# Altium project CRD25DA12N-FMC V2 (09-2024).PrjPcb (part 9 of 9)
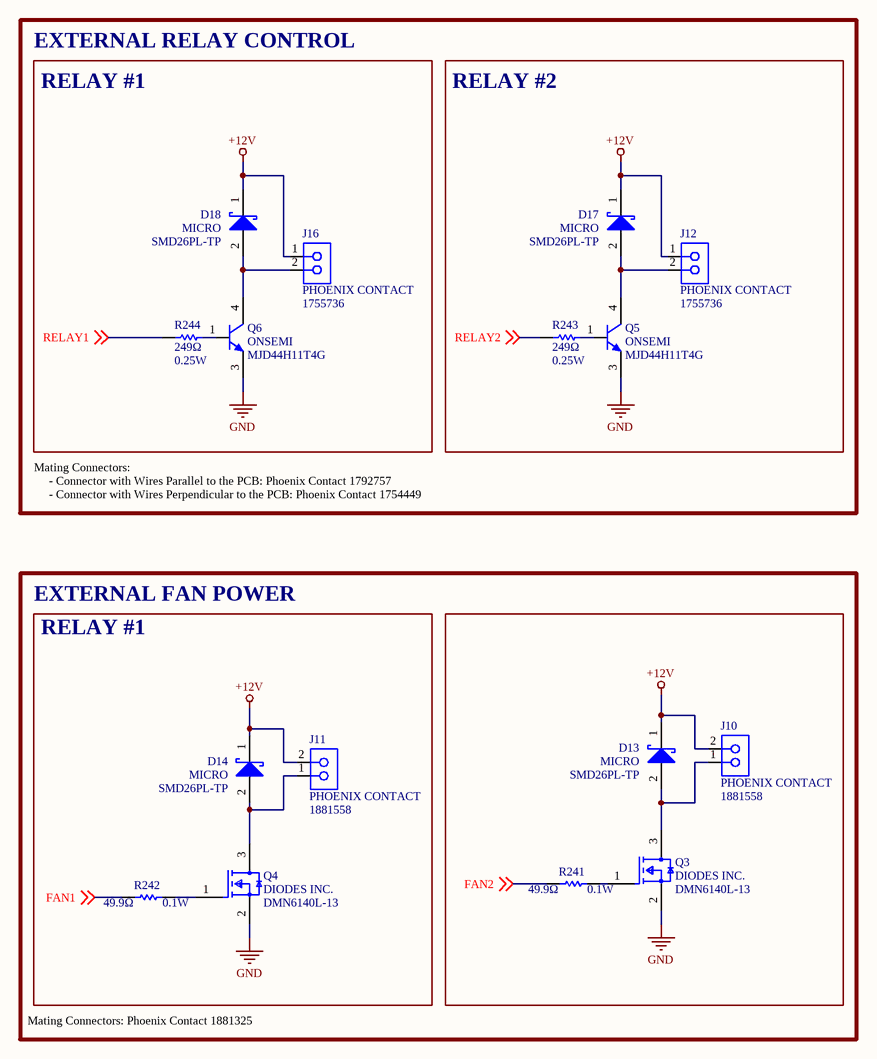
[diagram p12: 09 - Controlled Power.SchDoc]

## Nets that join several sheets
+1.65V_R: 04 - Auxiliary Power (C184.1 U43.1), 08 - Resolver (6 pins)
+1.65V_V: 04 - Auxiliary Power (C5.1 U31.1), 06 - Voltage Sense (R40.2 R42.2 R44.2)
+3.3V: 03 - Controller (16 pins), 04 - Auxiliary Power (8 pins), 06 - Voltage Sense (8 pins), 07 - Current-Temp Sense (14 pins), 08 - Resolver (8 pins)
+3.3V_I: 04 - Auxiliary Power (C13.1 U32.5), 07 - Current-Temp Sense (R199.2 R204.2 R210.2)
+5V: 03 - Controller (11 pins), 04 - Auxiliary Power (13 pins), 05 - Gate Drivers (11 pins)
+5V_ALT: 04 - Auxiliary Power (C56.1 U16.3), 05 - Gate Drivers (9 pins)
+5V_ISO: 03 - Controller (C141.1 J4.9 R192.2 U36.8), 04 - Auxiliary Power (C128.1 U8.5)
+5V_NTC: 04 - Auxiliary Power (C12.1 U6.5), 07 - Current-Temp Sense (C14.1 C17.1 R53.2 U7.1)
+12V: 02 - Power Stage (R80.1 R81.1 R115.1 R119.1), 03 - Controller (J9.12), 04 - Auxiliary Power (20 pins), 05 - Gate Drivers (6 pins), 09 - Controlled Power (8 pins)
+15V: 02 - Power Stage (6 pins), 04 - Auxiliary Power (14 pins), 08 - Resolver (12 pins)
-15V: 02 - Power Stage (6 pins), 04 - Auxiliary Power (11 pins)
GND: 02 - Power Stage (12 pins), 03 - Controller (53 pins), 04 - Auxiliary Power (81 pins), 05 - Gate Drivers (48 pins), 06 - Voltage Sense (20 pins), 07 - Current-Temp Sense (33 pins), 08 - Resolver (26 pins), 09 - Controlled Power (Q3.2 Q4.2 Q5.3 Q6.3)
GND_ISO: 03 - Controller (6 pins), 04 - Auxiliary Power (C128.2 U8.4)
GND_NTC: 02 - Power Stage (Q2.NTC1), 04 - Auxiliary Power (C12.2 U6.4), 07 - Current-Temp Sense (6 pins)
COS: 03 - Controller (U5.34), 08 - Resolver (C23.1 R62.2)
DC+: 02 - Power Stage (12 pins), 06 - Voltage Sense (R13.1)
DC-: 02 - Power Stage (12 pins), 06 - Voltage Sense (R160.1)
FAN1: 03 - Controller (U38.16), 09 - Controlled Power (R242.1)
FAN2: 03 - Controller (U38.15), 09 - Controlled Power (R241.1)
G1: 02 - Power Stage (J6.1 Q2.G1), 05 - Gate Drivers (R94.2 R97.2 R105.2)
G2: 02 - Power Stage (J13.1 Q2.G2), 05 - Gate Drivers (R120.2 R123.2 R131.2)
G3: 02 - Power Stage (J7.1 Q2.G3), 05 - Gate Drivers (R64.2 R67.2 R74.2)
G4: 02 - Power Stage (J14.1 Q2.G4), 05 - Gate Drivers (R121.2 R124.2 R132.2)
G5: 02 - Power Stage (J8.1 Q2.G5), 05 - Gate Drivers (R65.2 R68.2 R75.2)
G6: 02 - Power Stage (J15.1 Q2.G6), 05 - Gate Drivers (R95.2 R98.2 R106.2)
GD_DIS: 03 - Controller (U5.74), 05 - Gate Drivers (R83.1)
IU: 02 - Power Stage (U26.9), 07 - Current-Temp Sense (R125.2 R128.1)
IU_MEAS: 03 - Controller (U5.33), 07 - Current-Temp Sense (C22.1 R206.2)
IV: 02 - Power Stage (U27.9), 07 - Current-Temp Sense (R117.2 R122.1)
IV_MEAS: 03 - Controller (U5.37), 07 - Current-Temp Sense (C24.1 R209.2)
IW: 02 - Power Stage (U28.9), 07 - Current-Temp Sense (R113.2 R114.1)
IW_MEAS: 03 - Controller (U5.39), 07 - Current-Temp Sense (C25.1 R63.2)
NTC1: 02 - Power Stage (Q2.NTC2), 07 - Current-Temp Sense (C18.1 R53.1 R55.2 U7.2)
NTC_ISO: 03 - Controller (U5.36), 07 - Current-Temp Sense (C21.1 R59.2)
RELAY1: 03 - Controller (U38.17), 09 - Controlled Power (R244.1)
RELAY2: 03 - Controller (U38.18), 09 - Controlled Power (R243.1)
RSLV_PWM: 03 - Controller (U5.64), 08 - Resolver (R247.1)
S1: 02 - Power Stage (J6.2,3,4,5 Q2.S1), 05 - Gate Drivers (6 pins)
S2: 02 - Power Stage (J13.2,3,4,5 Q2.S2), 05 - Gate Drivers (6 pins)
S3: 02 - Power Stage (J7.2,3,4,5 Q2.S3), 05 - Gate Drivers (6 pins)
S4: 02 - Power Stage (J14.2,3,4,5 Q2.S4), 05 - Gate Drivers (6 pins)
S5: 02 - Power Stage (J8.2,3,4,5 Q2.S5), 05 - Gate Drivers (6 pins)
S6: 02 - Power Stage (J15.2,3,4,5 Q2.S6), 05 - Gate Drivers (6 pins)
SIN: 03 - Controller (U5.30), 08 - Resolver (C19.1 R60.2)
T_AMB: 03 - Controller (U5.31), 07 - Current-Temp Sense (R85.1 U14.1)
U_HS_PWM: 03 - Controller (U5.49), 05 - Gate Drivers (U11.6)
U_LS_PWM: 03 - Controller (U5.51), 05 - Gate Drivers (U11.5)
V_HS_PWM: 03 - Controller (U5.53), 05 - Gate Drivers (U11.3)
V_LS_PWM: 03 - Controller (U5.55), 05 - Gate Drivers (U11.2)
VDC_MEAS: 03 - Controller (U5.27), 06 - Voltage Sense (C134.1 R57.2)
VU_MEAS: 03 - Controller (U5.15), 06 - Voltage Sense (C125.1 R51.2)
VV_MEAS: 03 - Controller (U5.17), 06 - Voltage Sense (C127.1 R52.2)
VW_MEAS: 03 - Controller (U5.25), 06 - Voltage Sense (C129.1 R54.2)
W_HS_PWM: 03 - Controller (U5.50), 05 - Gate Drivers (U11.9)
W_LS_PWM: 03 - Controller (U5.52), 05 - Gate Drivers (U11.8)